# Altium project Main IF Board 6.PrjPcb
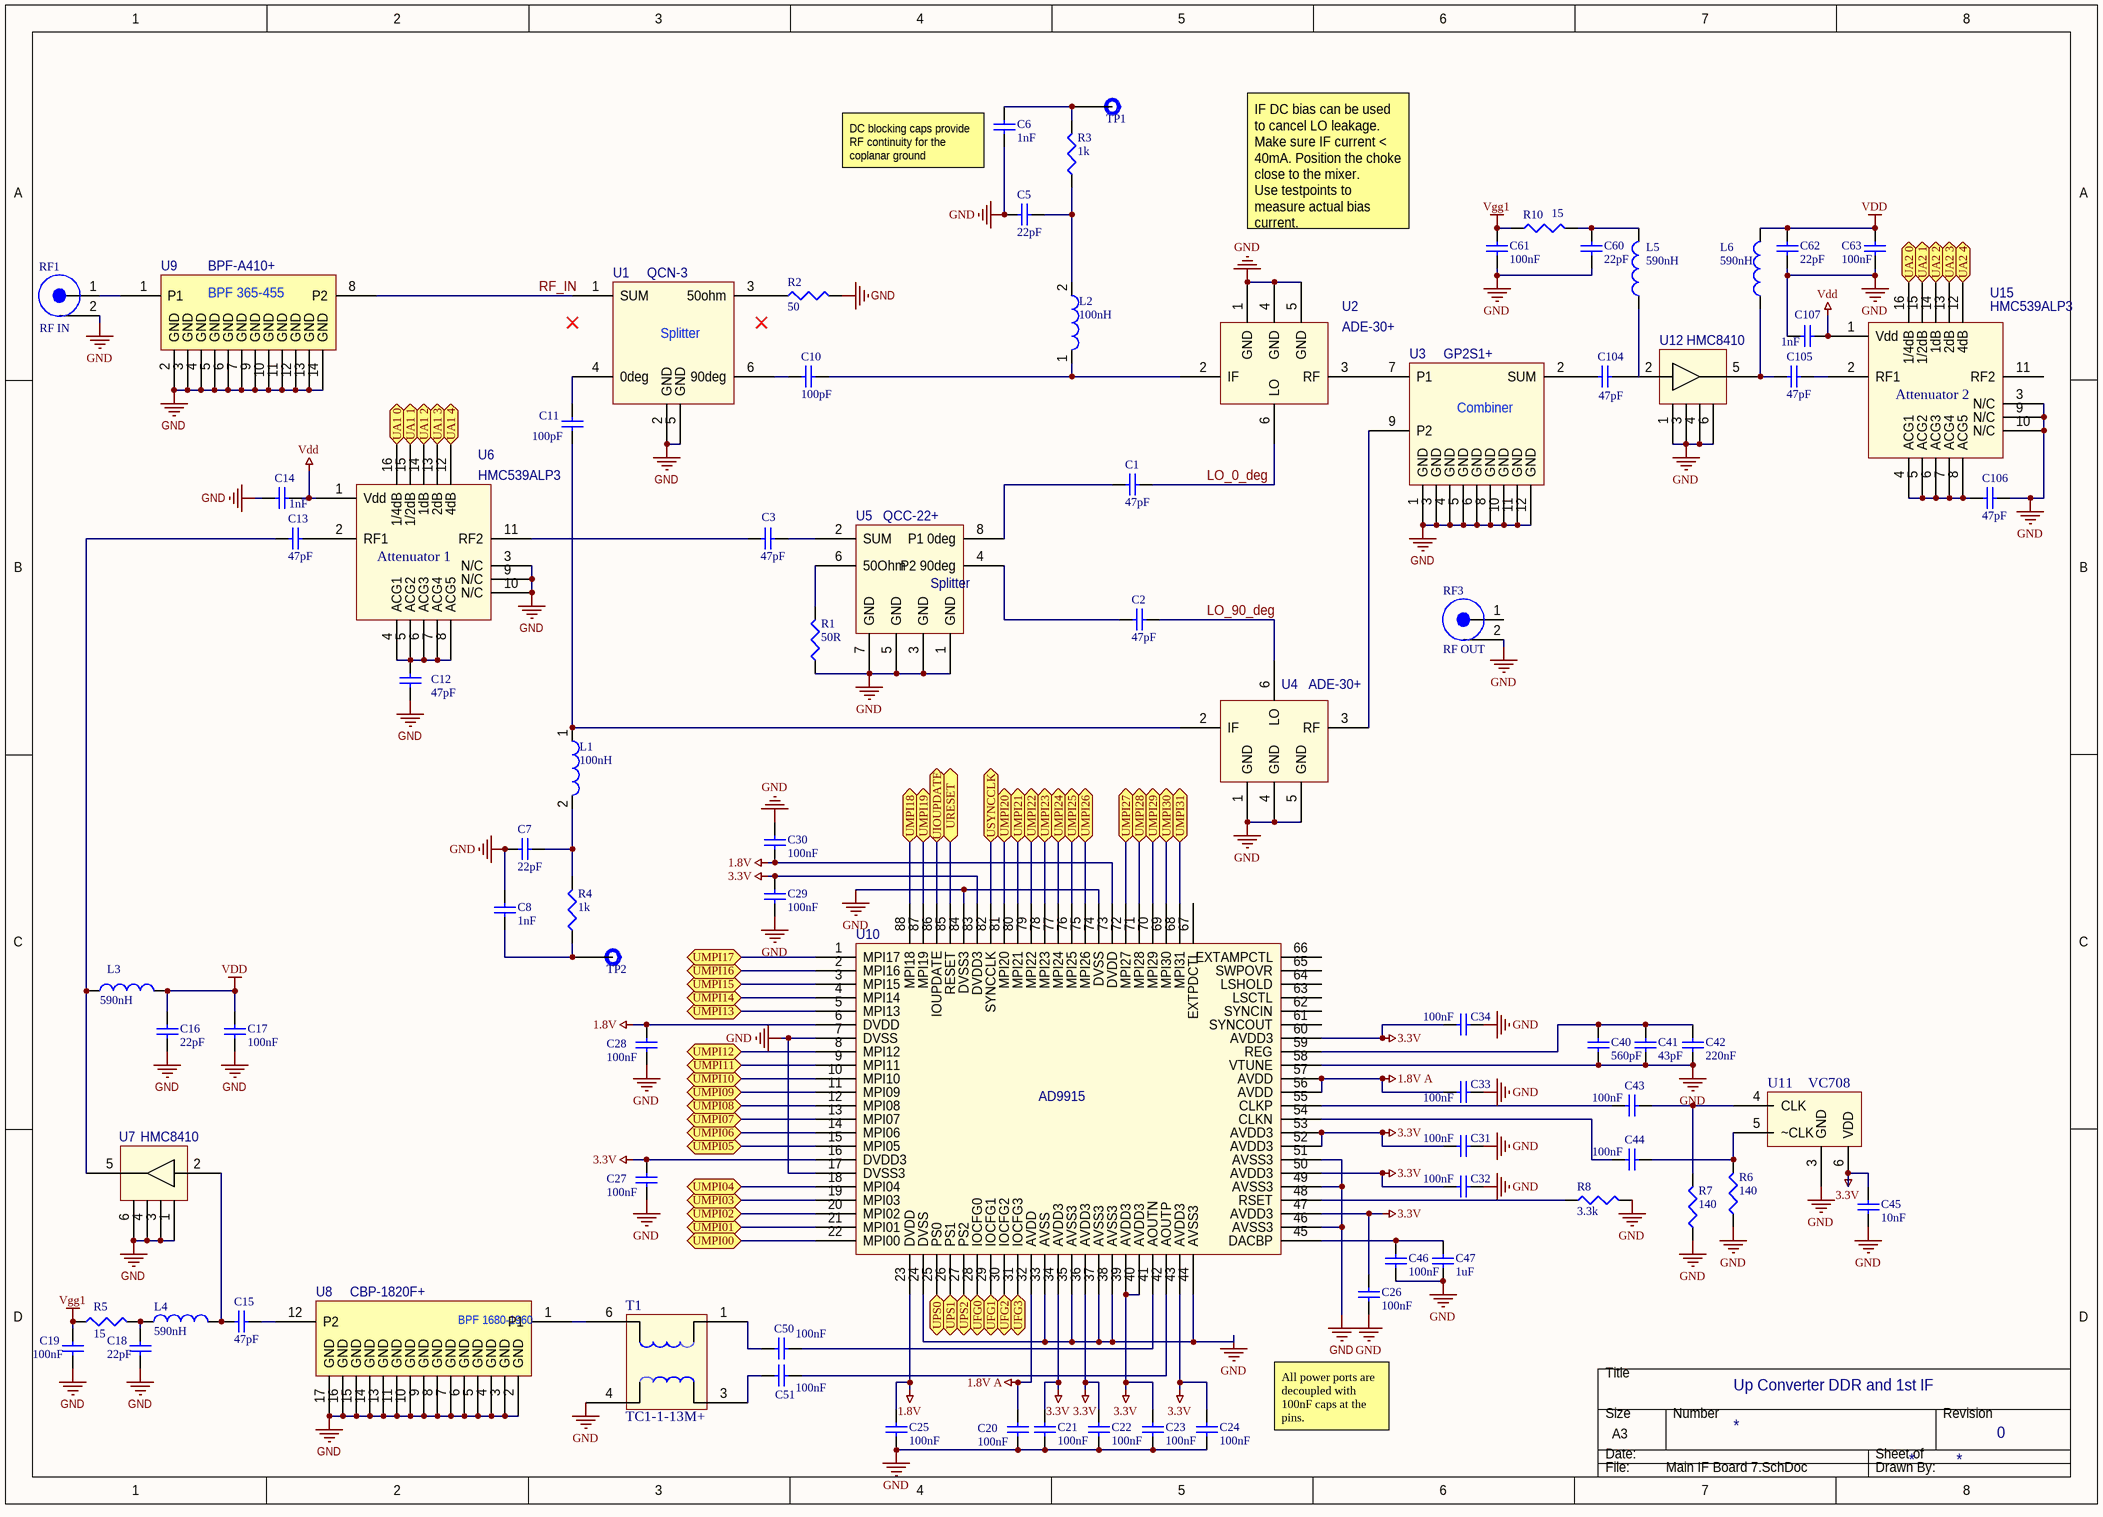
[diagram p0: Main IF Board 7.SchDoc]
2 sheets, 84 parts. Net scope: flat (ports and power ports of the same name join across sheets).
Sheets:
  Main IF Board 7.SchDoc
  Main IF Board A.SchDoc

## Sheet Main IF Board 7.SchDoc: Up Converter DDR and 1st IF
size A3; Author: L Lerner; Revision: 0

### Parts
C1  value 47pF  [CAP0402]  (hidden comment: ATC520L103KT16T)
C2  value 47pF  [CAP0402]  (hidden comment: ATC520L103KT16T)
C3  value 47pF  [CAP0402]  (hidden comment: ATC520L103KT16T)
C5  value 22pF  [CAP0402]  (hidden comment: Capacitor)
C6  value 1nF  [CAP0603]  (hidden comment: Capacitor)
C7  value 22pF  [CAP0402]  (hidden comment: Capacitor)
C8  value 1nF  [CAP0603]  (hidden comment: Capacitor)
C10  value 100pF  [CAP0402]  (hidden comment: Capacitor)
C11  value 100pF  [CAP0402]  (hidden comment: Capacitor)
C12  value 47pF  [CAP0402]  (hidden comment: Capacitor)
C13  value 47pF  [CAP0402]  (hidden comment: Capacitor)
C14  value 1nF  [CAP0402]  (hidden comment: Capacitor)
C15  value 47pF  [CAP0402]  (hidden comment: Capacitor)
C16  value 22pF  [CAP0402]  (hidden comment: Capacitor)
C17  value 100nF  [CAP0402]  (hidden comment: Capacitor)
C18  value 22pF  [CAP0402]  (hidden comment: Capacitor)
C19  value 100nF  [CAP0603]  (hidden comment: Capacitor)
C20  value 100nF  [CAP0402]  (hidden comment: Capacitor)
C21  value 100nF  [CAP0402]  (hidden comment: Capacitor)
C22  value 100nF  [CAP0402]  (hidden comment: Capacitor)
C23  value 100nF  [CAP0402]  (hidden comment: Capacitor)
C24  value 100nF  [CAP0402]  (hidden comment: Capacitor)
C25  value 100nF  [CAP0402]  (hidden comment: Capacitor)
C26  value 100nF  [CAP0402]  (hidden comment: Capacitor)
C27  value 100nF  [CAP0402]  (hidden comment: Capacitor)
C28  value 100nF  [CAP0402]  (hidden comment: Capacitor)
C29  value 100nF  [CAP0402]  (hidden comment: Capacitor)
C30  value 100nF  [CAP0402]  (hidden comment: Capacitor)
C31  value 100nF  [CAP0402]  (hidden comment: Capacitor)
C32  value 100nF  [CAP0402]  (hidden comment: Capacitor)
C33  value 100nF  [CAP0402]  (hidden comment: Capacitor)
C34  value 100nF  [CAP0402]  (hidden comment: Capacitor)
C40  value 560pF  [CAP0402]  (hidden comment: Capacitor)
C41  value 43pF  [CAP0402]  (hidden comment: Capacitor)
C42  value 220nF  [CAP0603]  (hidden comment: Capacitor)
C43  value 100nF  [CAP0402]  (hidden comment: Capacitor)
C44  value 100nF  [CAP0402]  (hidden comment: Capacitor)
C45  value 10nF  [CAP0402]  (hidden comment: Capacitor)
C46  value 100nF  [CAP0402]  (hidden comment: Capacitor)
C47  value 1uF  [CAP0603]  (hidden comment: Capacitor)
C50  value 100nF  [CAP0402]  (hidden comment: Capacitor)
C51  value 100nF  [CAP0402]  (hidden comment: Capacitor)
C60  value 22pF  [CAP0402]  (hidden comment: Capacitor)
C61  value 100nF  [CAP0402]  (hidden comment: Capacitor)
C62  value 22pF  [CAP0402]  (hidden comment: Capacitor)
C63  value 100nF  [CAP0402]  (hidden comment: Capacitor)
C104  value 47pF  [CAP0402]  (hidden comment: ATC520L103KT16T)
C105  value 47pF  [CAP0402]  (hidden comment: Capacitor)
C106  value 47pF  [CAP0402]  (hidden comment: Capacitor)
C107  value 1nF  [CAP0402]  (hidden comment: Capacitor)
L1  value 100nH  [Coilcraft_BCL-122]  (hidden comment: Inductor)
L2  value 100nH  [Coilcraft_BCL-122]  (hidden comment: Inductor)
L3  value 590nH  [CAP0402]  (hidden comment: Inductor)
L4  value 590nH  [CAP0402]  (hidden comment: Inductor)
L5  value 590nH  [CAP0402]  (hidden comment: Inductor)
L6  value 590nH  [TBD]  (hidden comment: Inductor)
R1  value 50R  [RES0603]  (hidden comment: Resistor)
R2  value 50  [RES0603]  (hidden comment: Resistor)
R3  value 1k  [RES0603]  (hidden comment: Resistor)
R4  value 1k  [RES0603]  (hidden comment: Resistor)
R5  value 15  [RES0402]  (hidden comment: Resistor)
R6  value 140  [RES0402]  (hidden comment: Resistor)
R7  value 140  [RES0402]  (hidden comment: Resistor)
R8  value 3.3k  [RES0402]  (hidden comment: Resistor)
R10  value 15  [RES0402]  (hidden comment: Resistor)
RF1  RF IN  [SMA_edge_launch_cutout_Cinch]
RF3  RF OUT  [SMA_edge_launch_cutout_Cinch]
T1  TC1-1-13M+
TP1  TP1  [1XHeader 100mil]  (value not drawn)
TP2  TP2  [1XHeader 100mil]  (value not drawn)
U1  QCN-3  [FV1206-1]
U2  ADE-30+  [Minicircuits_CD542]
U3  GP2S1+  [DQ1225]
U4  ADE-30+  [Minicircuits_CD542]
U5  QCC-22+  [Minicircuits_GF981]
U6  HMC539ALP3
U7  HMC8410
U8  CBP-1820F+  [CBP-1820F+]
U9  BPF-A410+  [BPF-A410+]
U10  AD9915  [AD9915]
U11  VC708  [VC708]
U12  HMC8410  [HMC8410]
U15  HMC539ALP3  [HMC539ALP3]

### Ports
UA1 0 (bidir), UA1 1 (bidir), UA1 2 (bidir), UA1 3 (bidir), UA1 4 (bidir), UA2 0 (bidir), UA2 1 (bidir), UA2 2 (bidir), UA2 3 (bidir), UA2 4 (bidir), UFG0 (bidir), UFG1 (bidir), UFG2 (bidir), UFG3 (bidir), UIOUPDATE (bidir), UMPI00 (bidir), UMPI01 (bidir), UMPI02 (bidir), UMPI03 (bidir), UMPI04 (bidir), UMPI05 (bidir), UMPI06 (bidir), UMPI07 (bidir), UMPI08 (bidir), UMPI09 (bidir), UMPI10 (bidir), UMPI11 (bidir), UMPI12 (bidir), UMPI13 (bidir), UMPI14 (bidir), UMPI15 (bidir), UMPI16 (bidir), UMPI17 (bidir), UMPI18 (bidir), UMPI19 (bidir), UMPI20 (bidir), UMPI21 (bidir), UMPI22 (bidir), UMPI23 (bidir), UMPI24 (bidir), UMPI25 (bidir), UMPI26 (bidir), UMPI27 (bidir), UMPI28 (bidir), UMPI29 (bidir), UMPI30 (bidir), UMPI31 (bidir), UPS0 (bidir), UPS1 (bidir), UPS2 (bidir), URESET (bidir), USYNCCLK (bidir)

### Nets
1.8V: C25.2 C28.2 C30.1 U10.6(DVDD) U10.23(DVDD) U10.73(DVDD)
1.8V A: C20.2 C33.1 U10.32(AVDD) U10.56(AVDD) U10.57(AVDD)
3.3V: C21.2 C22.2 C23.2 C24.2 C26.2 C27.1 C29.2 C31.1 C32.1 C34.1 C45.2 U10.16(DVDD3) U10.34(AVDD3) U10.36(AVDD3) U10.39(AVDD3) U10.40(AVDD3) U10.43(AVDD3) U10.47(AVDD3) U10.50(AVDD3) U10.52(AVDD3) U10.53(AVDD3) U10.60(AVDD3) U10.83(DVDD3) U11.6(VDD)
GND: C5.1 C6.2 C7.1 C8.2 C12.1 C14.1 C16.1 C17.1 C18.1 C19.1 C20.1 C21.1 C22.1 C23.1 C24.1 C25.1 C26.1 C27.2 C28.1 C29.1 C30.2 C31.2 C32.2 C33.2 C34.2 C40.1 C41.1 C42.1 C45.1 C46.1 C47.1 C60.1 C61.1 C62.1 C63.1 C106.2 C107.1 R1.1 R2.2 R6.1 R7.1 R8.2 RF1.2 RF3.2 T1.4 U1.2(GND) U1.5(GND) U2.1(GND) U2.4(GND) U2.5(GND) U3.1(GND) U3.3(GND) U3.4(GND) U3.5(GND) U3.6(GND) U3.8(GND) U3.10(GND) U3.11(GND) U3.12(GND) U4.1(GND) U4.4(GND) U4.5(GND) U5.1(GND) U5.3(GND) U5.5(GND) U5.7(GND) U6.3(N/C) U6.9(N/C) U6.10(N/C) U7.1 U7.3 U7.4 U7.6 U8.2(GND) U8.3(GND) U8.4(GND) U8.5(GND) U8.6(GND) U8.7(GND) U8.8(GND) U8.9(GND) U8.10(GND) U8.11(GND) U8.13(GND) U8.14(GND) U8.15(GND) U8.16(GND) U8.17(GND) U9.2(GND) U9.3(GND) U9.4(GND) U9.5(GND) U9.6(GND) U9.7(GND) U9.9(GND) U9.10(GND) U9.11(GND) U9.12(GND) U9.13(GND) U9.14(GND) U10.7(DVSS) U10.17(DVSS3) U10.24(DVSS) U10.33(AVSS) U10.35(AVSS3) U10.37(AVSS3) U10.38(AVSS3) U10.44(AVSS3) U10.46(AVSS3) U10.49(AVSS3) U10.51(AVSS3) U10.58(VTUNE) U10.74(DVSS) U10.84(DVSS3) U11.3(GND) U12.1 U12.3 U12.4 U12.6 U15.3(N/C) U15.9(N/C) U15.10(N/C)
VDD: C14.2 C16.2 C17.2 C62.2 C63.2 C107.2 L3.2 L6.2 U6.1(Vdd) U15.1(Vdd)
Vgg1: C19.2 C61.2 R5.1 R10.1
LO_0_deg: C1.1 U2.6(LO)
LO_90_deg: C2.2 U4.6(LO)
RF_IN: U1.1(SUM) U9.8(P2)
NetC1_2: C1.2 U5.8(P1_0deg)
NetC2_1: C2.1 U5.4(P2_90deg)
NetC3_1: C3.1 U6.11(RF2)
NetC3_2: C3.2 U5.2(SUM)
NetC5_2: C5.2 L2.2 R3.2
NetC6_1: C6.1 R3.1 TP1.1
NetC7_2: C7.2 L1.2 R4.2
NetC8_1: C8.1 R4.1 TP2.1
NetC10_1: C10.1 U1.6(90deg)
NetC10_2: C10.2 L2.1 U2.2(IF)
NetC11_1: C11.1 U1.4(0deg)
NetC11_2: C11.2 L1.1 U4.2(IF)
NetC12_2: C12.2 U6.4(ACG1) U6.5(ACG2) U6.6(ACG3) U6.7(ACG4) U6.8(ACG5)
NetC13_1: C13.1 L3.1 U7.5
NetC13_2: C13.2 U6.2(RF1)
NetC15_1: C15.1 L4.2 U7.2
NetC15_2: C15.2 U8.12(P2)
NetC18_2: C18.2 L4.1 R5.2
NetC40_2: C40.2 C41.2 C42.2 U10.59(REG)
NetC43_1: C43.1 U10.55(CLKP)
NetC43_2: C43.2 R7.2 U11.4(CLK)
NetC44_1: C44.1 U10.54(CLKN)
NetC44_2: C44.2 R6.2 U11.5(~CLK)
NetC46_2: C46.2 C47.2 U10.45(DACBP)
NetC50_1: C50.1 T1.1
NetC50_2: C50.2 U10.41(AOUTN)
NetC51_1: C51.1 T1.3
NetC51_2: C51.2 U10.42(AOUTP)
NetC60_2: C60.2 L5.2 R10.2
NetC104_1: C104.1 U12.2
NetC104_2: C104.2 U3.2(SUM)
NetC105_1: C105.1 L6.1 U12.5
NetC105_2: C105.2 U15.2(RF1)
NetC106_1: C106.1 U15.4(ACG1) U15.5(ACG2) U15.6(ACG3) U15.7(ACG4) U15.8(ACG5)
NetJXN_213: U10.87(MPI19) ; port UMPI19
NetJXN_217: U10.86(IOUPDATE) ; port UIOUPDATE
NetJXN_218: U10.18(MPI04) ; port UMPI04
NetJXN_219: U10.5(MPI13) ; port UMPI13
NetJXN_220: U10.19(MPI03) ; port UMPI03
NetJXN_223: U10.4(MPI14) ; port UMPI14
NetJXN_224: U10.20(MPI02) ; port UMPI02
NetJXN_226: U10.21(MPI01) ; port UMPI01
NetJXN_229: U15.15(1/2dB) ; port UA2 1
NetJXN_230: U10.22(MPI00) ; port UMPI00
NetJXN_231: U15.16(1/4dB) ; port UA2 0
NetJXN_235: U6.12(4dB) ; port UA1 4
NetJXN_236: U10.68(MPI31) ; port UMPI31
NetJXN_237: U6.13(2dB) ; port UA1 3
NetJXN_238: U10.69(MPI30) ; port UMPI30
NetJXN_241: U10.76(MPI25) ; port UMPI25
NetJXN_242: U10.72(MPI27) ; port UMPI27
NetJXN_243: U10.77(MPI24) ; port UMPI24
NetJXN_244: U10.75(MPI26) ; port UMPI26
NetJXN_248: U10.82(SYNCCLK) ; port USYNCCLK
NetJXN_253: U10.80(MPI21) ; port UMPI21
NetJXN_254: U10.78(MPI23) ; port UMPI23
NetJXN_255: U10.81(MPI20) ; port UMPI20
NetJXN_256: U10.79(MPI22) ; port UMPI22
NetJXN_261: U10.70(MPI29) ; port UMPI29
NetJXN_262: U10.8(MPI12) ; port UMPI12
NetJXN_263: U10.71(MPI28) ; port UMPI28
NetJXN_264: U10.9(MPI11) ; port UMPI11
NetJXN_267: U10.14(MPI06) ; port UMPI06
NetJXN_268: U15.13(2dB) ; port UA2 3
NetJXN_269: U10.15(MPI05) ; port UMPI05
NetJXN_270: U15.14(1dB) ; port UA2 2
NetJXN_273: U10.2(MPI16) ; port UMPI16
NetJXN_274: U6.14(1dB) ; port UA1 2
NetJXN_275: U10.3(MPI15) ; port UMPI15
NetJXN_276: U6.15(1/2dB) ; port UA1 1
NetJXN_281: U10.88(MPI18) ; port UMPI18
NetJXN_282: U6.16(1/4dB) ; port UA1 0
NetJXN_283: U10.1(MPI17) ; port UMPI17
NetJXN_284: U15.12(4dB) ; port UA2 4
NetJXN_287: U10.12(MPI08) ; port UMPI08
NetJXN_288: U10.10(MPI10) ; port UMPI10
NetJXN_289: U10.13(MPI07) ; port UMPI07
NetJXN_290: U10.11(MPI09) ; port UMPI09
NetR1_2: R1.2 U5.6(50Ohm)
NetR2_1: R2.1 U1.3(50ohm)
NetR8_1: R8.1 U10.48(RSET)
NetRF1_1: RF1.1 U9.1(P1)
NetT1_6: T1.6 U8.1(P1)
NetU2_3: U2.3(RF) U3.7(P1)
NetU3_9: U3.9(P2) U4.3(RF)
NetU10_25: U10.25(PS0) ; port UPS0
NetU10_26: U10.26(PS1) ; port UPS1
NetU10_27: U10.27(PS2) ; port UPS2
NetU10_28: U10.28(IOCFG0) ; port UFG0
NetU10_29: U10.29(IOCFG1) ; port UFG1
NetU10_30: U10.30(IOCFG2) ; port UFG2
NetU10_31: U10.31(IOCFG3) ; port UFG3
NetU10_85: U10.85(RESET) ; port URESET

Not connected (* = marked no-connect by the designer): L5 1; RF3 1; U10 61(SYNCOUT) 62(SYNCIN) 63(LSCTL) 64(LSHOLD) 65(SWPOVR) 66(EXTAMPCTL) 67(EXTPDCTL); U15 11(RF2)

### Notes on the sheet
- (near C6) DC blocking caps provide RF continuity for the coplanar ground
- IF DC bias can be used to cancel LO leakage. Make sure IF current < 40mA. Position the choke close to the mixer.
  Use testpoints to measure actual bias current.
- (near U15) Attenuator 2
- (near U6) Attenuator 1
- All power ports are decoupled with 100nF caps at the pins.
- (in symbol BPF-A410+) BPF 365-455
- (in symbol CBP-1820F+) BPF 1680-1960
- (in symbol GP2S1+) Combiner
- (in symbol minicircuits_QCC-22+) Splitter
- (in symbol QCN-3) Splitter

### Library data of the parts
C1-C3 C104 = Capacitor
L3 L4 = Inductor: Model: 0402DF-591XJRU
RF1 RF3 = RF_connector: RF connector w/  pin and barrel
T1 = Trans: Published: 24-Mar-1999; LatestRevisionDate: 08-Jul-2005; LatestRevisionNote: Mech Layer 1 removed.; PackageReference: TRANS; Publisher: Altium Limited; PackageDescription: Transformer; 4 Leads
TP1 TP2 = Test point
U2 U4 = minicircuits_ADE-30+: Minicircuits mixer ADE-30+, 200MHz-3000MHz
U5 = minicircuits_QCC-22+: Mini-Circuits_ power splitter/combiner QCC-22+, 1.5-2.5GHz
U11 = VC-708
C5-C8 C10-C34 C40-C47 C50 C51 C60-C63 C105-C107 = Capacitor
  C10-C34 C40-C47 C50 C51 C60-C63 C105-C107: Dielectric: *; Model: *; Voltage: *
L1 L2 L5 L6 = Inductor
  L5 L6: Model: *
R1-R8 R10 = Resistor
  R2-R8 R10: Type: *; Model: *

## Sheet Main IF Board A.SchDoc: Up/Down Converter SOM Header
size A4
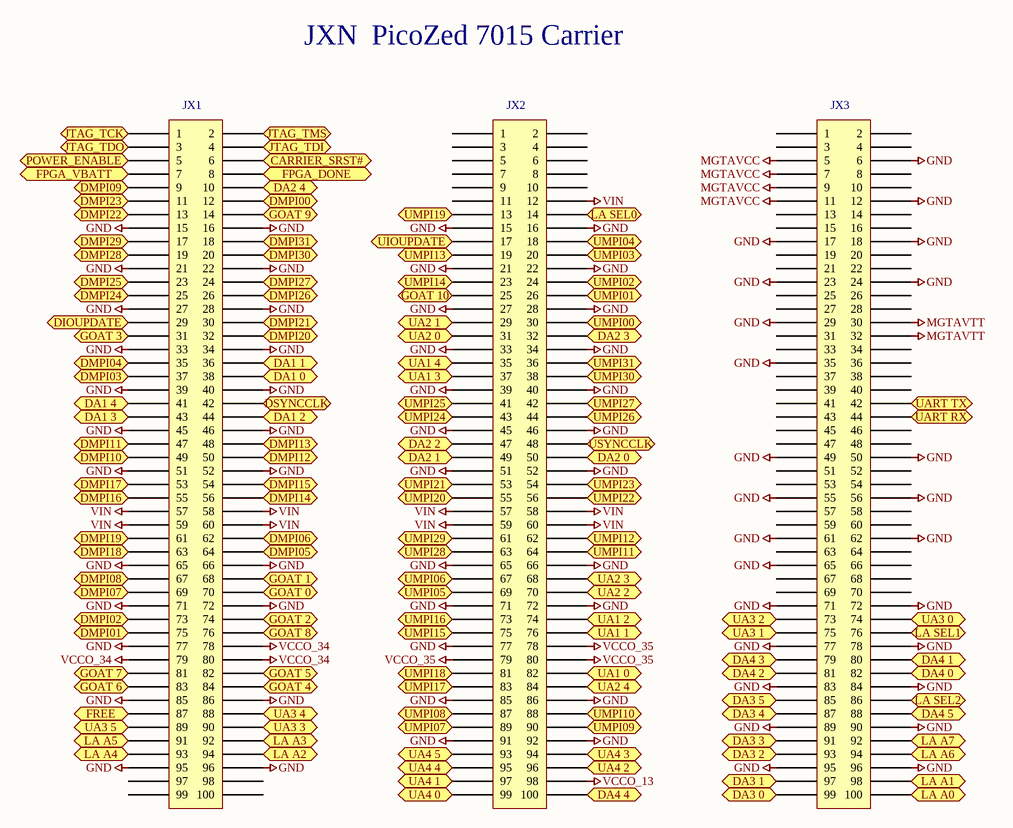
[diagram p1: Main IF Board A.SchDoc]

### Parts
JXN  PicoZed 7015 Carrier  [BergStak61083]

### Ports
CARRIER_SRST# (bidir), DA1 0 (bidir), DA1 1 (bidir), DA1 2 (bidir), DA1 3 (bidir), DA1 4 (bidir), DA2 0 (bidir), DA2 1 (bidir), DA2 2 (bidir), DA2 3 (bidir), DA2 4 (bidir), DA3 0 (bidir), DA3 1 (bidir), DA3 2 (bidir), DA3 3 (bidir), DA3 4 (bidir), DA3 5 (bidir), DA4 0 (bidir), DA4 1 (bidir), DA4 2 (bidir), DA4 3 (bidir), DA4 4 (bidir), DA4 5 (bidir), DIOUPDATE (bidir), DMPI00 (bidir), DMPI01 (bidir), DMPI02 (bidir), DMPI03 (bidir), DMPI04 (bidir), DMPI05 (bidir), DMPI06 (bidir), DMPI07 (bidir), DMPI08 (bidir), DMPI09 (bidir), DMPI10 (bidir), DMPI11 (bidir), DMPI12 (bidir), DMPI13 (bidir), DMPI14 (bidir), DMPI15 (bidir), DMPI16 (bidir), DMPI17 (bidir), DMPI18 (bidir), DMPI19 (bidir), DMPI20 (bidir), DMPI21 (bidir), DMPI22 (bidir), DMPI23 (bidir), DMPI24 (bidir), DMPI25 (bidir), DMPI26 (bidir), DMPI27 (bidir), DMPI28 (bidir), DMPI29 (bidir), DMPI30 (bidir), DMPI31 (bidir), DSYNCCLK (bidir), FPGA_DONE (bidir), FPGA_VBATT (bidir), FREE (bidir), GOAT 0 (bidir), GOAT 1 (bidir), GOAT 2 (bidir), GOAT 3 (bidir), GOAT 4 (bidir), GOAT 5 (bidir), GOAT 6 (bidir), GOAT 7 (bidir), GOAT 8 (bidir), GOAT 9 (bidir), GOAT 10 (bidir), JTAG_TCK (bidir), JTAG_TDI (bidir), JTAG_TDO (bidir), JTAG_TMS (bidir), LA A0 (bidir), LA A1 (bidir), LA A2 (bidir), LA A3 (bidir), LA A4 (bidir), LA A5 (bidir), LA A6 (bidir), LA A7 (bidir), LA SEL0 (bidir), LA SEL1 (bidir), LA SEL2 (bidir), POWER_ENABLE (bidir), UA1 0 (bidir), UA1 1 (bidir), UA1 2 (bidir), UA1 3 (bidir), UA1 4 (bidir), UA2 0 (bidir), UA2 1 (bidir), UA2 2 (bidir), UA2 3 (bidir), UA2 4 (bidir), UA3 0 (bidir), UA3 1 (bidir), UA3 2 (bidir), UA3 3 (bidir), UA3 4 (bidir), UA3 5 (bidir), UA4 0 (bidir), UA4 1 (bidir), UA4 2 (bidir), UA4 3 (bidir), UA4 4 (bidir), UA4 5 (bidir), UART RX (bidir), UART TX (bidir), UIOUPDATE (bidir), UMPI00 (bidir), UMPI01 (bidir), UMPI02 (bidir), UMPI03 (bidir), UMPI04 (bidir), UMPI05 (bidir), UMPI06 (bidir), UMPI07 (bidir), UMPI08 (bidir), UMPI09 (bidir), UMPI10 (bidir), UMPI11 (bidir), UMPI12 (bidir), UMPI13 (bidir), UMPI14 (bidir), UMPI15 (bidir), UMPI16 (bidir), UMPI17 (bidir), UMPI18 (bidir), UMPI19 (bidir), UMPI20 (bidir), UMPI21 (bidir), UMPI22 (bidir), UMPI23 (bidir), UMPI24 (bidir), UMPI25 (bidir), UMPI26 (bidir), UMPI27 (bidir), UMPI28 (bidir), UMPI29 (bidir), UMPI30 (bidir), UMPI31 (bidir), USYNCCLK (bidir)

### Nets
GND: JXN.115(15) JXN.116(16) JXN.121(21) JXN.122(22) JXN.127(27) JXN.128(28) JXN.133(33) JXN.134(34) JXN.139(39) JXN.140(40) JXN.145(45) JXN.146(46) JXN.151(51) JXN.152(52) JXN.165(65) JXN.166(66) JXN.171(71) JXN.172(72) JXN.177(77) JXN.185(85) JXN.186(86) JXN.195(95) JXN.196(96) JXN.215(15) JXN.216(16) JXN.221(21) JXN.222(22) JXN.227(27) JXN.228(28) JXN.233(33) JXN.234(34) JXN.239(39) JXN.240(40) JXN.245(45) JXN.246(46) JXN.251(51) JXN.252(52) JXN.265(65) JXN.266(66) JXN.271(71) JXN.272(72) JXN.277(77) JXN.285(85) JXN.286(86) JXN.291(91) JXN.292(92) JXN.306(6) JXN.312(12) JXN.317(17) JXN.318(18) JXN.323(23) JXN.324(24) JXN.329(29) JXN.335(35) JXN.349(49) JXN.350(50) JXN.355(55) JXN.356(56) JXN.361(61) JXN.362(62) JXN.365(65) JXN.371(71) JXN.372(72) JXN.377(77) JXN.378(78) JXN.383(83) JXN.384(84) JXN.389(89) JXN.390(90) JXN.395(95) JXN.396(96)
MGTAVCC: JXN.305(5) JXN.307(7) JXN.309(9) JXN.311(11)
MGTAVTT: JXN.330(30) JXN.332(32)
VCCO_13: JXN.298(98)
VCCO_34: JXN.178(78) JXN.179(79) JXN.180(80)
VCCO_35: JXN.278(78) JXN.279(79) JXN.280(80)
VIN: JXN.157(57) JXN.158(58) JXN.159(59) JXN.160(60) JXN.212(12) JXN.257(57) JXN.258(58) JXN.259(59) JXN.260(60)
NetJXN_101: JXN.101(1) ; port JTAG_TCK
NetJXN_102: JXN.102(2) ; port JTAG_TMS
NetJXN_103: JXN.103(3) ; port JTAG_TDO
NetJXN_104: JXN.104(4) ; port JTAG_TDI
NetJXN_105: JXN.105(5) ; port POWER_ENABLE
NetJXN_106: JXN.106(6) ; port CARRIER_SRST#
NetJXN_107: JXN.107(7) ; port FPGA_VBATT
NetJXN_108: JXN.108(8) ; port FPGA_DONE
NetJXN_109: JXN.109(9) ; port DMPI09
NetJXN_110: JXN.110(10) ; port DA2 4
NetJXN_111: JXN.111(11) ; port DMPI23
NetJXN_112: JXN.112(12) ; port DMPI00
NetJXN_113: JXN.113(13) ; port DMPI22
NetJXN_114: JXN.114(14) ; port GOAT 9
NetJXN_117: JXN.117(17) ; port DMPI29
NetJXN_118: JXN.118(18) ; port DMPI31
NetJXN_119: JXN.119(19) ; port DMPI28
NetJXN_120: JXN.120(20) ; port DMPI30
NetJXN_123: JXN.123(23) ; port DMPI25
NetJXN_124: JXN.124(24) ; port DMPI27
NetJXN_125: JXN.125(25) ; port DMPI24
NetJXN_126: JXN.126(26) ; port DMPI26
NetJXN_129: JXN.129(29) ; port DIOUPDATE
NetJXN_130: JXN.130(30) ; port DMPI21
NetJXN_131: JXN.131(31) ; port GOAT 3
NetJXN_132: JXN.132(32) ; port DMPI20
NetJXN_135: JXN.135(35) ; port DMPI04
NetJXN_136: JXN.136(36) ; port DA1 1
NetJXN_137: JXN.137(37) ; port DMPI03
NetJXN_138: JXN.138(38) ; port DA1 0
NetJXN_141: JXN.141(41) ; port DA1 4
NetJXN_142: JXN.142(42) ; port DSYNCCLK
NetJXN_143: JXN.143(43) ; port DA1 3
NetJXN_144: JXN.144(44) ; port DA1 2
NetJXN_147: JXN.147(47) ; port DMPI11
NetJXN_148: JXN.148(48) ; port DMPI13
NetJXN_149: JXN.149(49) ; port DMPI10
NetJXN_150: JXN.150(50) ; port DMPI12
NetJXN_153: JXN.153(53) ; port DMPI17
NetJXN_154: JXN.154(54) ; port DMPI15
NetJXN_155: JXN.155(55) ; port DMPI16
NetJXN_156: JXN.156(56) ; port DMPI14
NetJXN_161: JXN.161(61) ; port DMPI19
NetJXN_162: JXN.162(62) ; port DMPI06
NetJXN_163: JXN.163(63) ; port DMPI18
NetJXN_164: JXN.164(64) ; port DMPI05
NetJXN_167: JXN.167(67) ; port DMPI08
NetJXN_168: JXN.168(68) ; port GOAT 1
NetJXN_169: JXN.169(69) ; port DMPI07
NetJXN_170: JXN.170(70) ; port GOAT 0
NetJXN_173: JXN.173(73) ; port DMPI02
NetJXN_174: JXN.174(74) ; port GOAT 2
NetJXN_175: JXN.175(75) ; port DMPI01
NetJXN_176: JXN.176(76) ; port GOAT 8
NetJXN_181: JXN.181(81) ; port GOAT 7
NetJXN_182: JXN.182(82) ; port GOAT 5
NetJXN_183: JXN.183(83) ; port GOAT 6
NetJXN_184: JXN.184(84) ; port GOAT 4
NetJXN_187: JXN.187(87) ; port FREE
NetJXN_188: JXN.188(88) ; port UA3 4
NetJXN_189: JXN.189(89) ; port UA3 5
NetJXN_190: JXN.190(90) ; port UA3 3
NetJXN_191: JXN.191(91) ; port LA A5
NetJXN_192: JXN.192(92) ; port LA A3
NetJXN_193: JXN.193(93) ; port LA A4
NetJXN_194: JXN.194(94) ; port LA A2
NetJXN_213: JXN.213(13) ; port UMPI19
NetJXN_214: JXN.214(14) ; port LA SEL0
NetJXN_217: JXN.217(17) ; port UIOUPDATE
NetJXN_218: JXN.218(18) ; port UMPI04
NetJXN_219: JXN.219(19) ; port UMPI13
NetJXN_220: JXN.220(20) ; port UMPI03
NetJXN_223: JXN.223(23) ; port UMPI14
NetJXN_224: JXN.224(24) ; port UMPI02
NetJXN_225: JXN.225(25) ; port GOAT 10
NetJXN_226: JXN.226(26) ; port UMPI01
NetJXN_229: JXN.229(29) ; port UA2 1
NetJXN_230: JXN.230(30) ; port UMPI00
NetJXN_231: JXN.231(31) ; port UA2 0
NetJXN_232: JXN.232(32) ; port DA2 3
NetJXN_235: JXN.235(35) ; port UA1 4
NetJXN_236: JXN.236(36) ; port UMPI31
NetJXN_237: JXN.237(37) ; port UA1 3
NetJXN_238: JXN.238(38) ; port UMPI30
NetJXN_241: JXN.241(41) ; port UMPI25
NetJXN_242: JXN.242(42) ; port UMPI27
NetJXN_243: JXN.243(43) ; port UMPI24
NetJXN_244: JXN.244(44) ; port UMPI26
NetJXN_247: JXN.247(47) ; port DA2 2
NetJXN_248: JXN.248(48) ; port USYNCCLK
NetJXN_249: JXN.249(49) ; port DA2 1
NetJXN_250: JXN.250(50) ; port DA2 0
NetJXN_253: JXN.253(53) ; port UMPI21
NetJXN_254: JXN.254(54) ; port UMPI23
NetJXN_255: JXN.255(55) ; port UMPI20
NetJXN_256: JXN.256(56) ; port UMPI22
NetJXN_261: JXN.261(61) ; port UMPI29
NetJXN_262: JXN.262(62) ; port UMPI12
NetJXN_263: JXN.263(63) ; port UMPI28
NetJXN_264: JXN.264(64) ; port UMPI11
NetJXN_267: JXN.267(67) ; port UMPI06
NetJXN_268: JXN.268(68) ; port UA2 3
NetJXN_269: JXN.269(69) ; port UMPI05
NetJXN_270: JXN.270(70) ; port UA2 2
NetJXN_273: JXN.273(73) ; port UMPI16
NetJXN_274: JXN.274(74) ; port UA1 2
NetJXN_275: JXN.275(75) ; port UMPI15
NetJXN_276: JXN.276(76) ; port UA1 1
NetJXN_281: JXN.281(81) ; port UMPI18
NetJXN_282: JXN.282(82) ; port UA1 0
NetJXN_283: JXN.283(83) ; port UMPI17
NetJXN_284: JXN.284(84) ; port UA2 4
NetJXN_287: JXN.287(87) ; port UMPI08
NetJXN_288: JXN.288(88) ; port UMPI10
NetJXN_289: JXN.289(89) ; port UMPI07
NetJXN_290: JXN.290(90) ; port UMPI09
NetJXN_293: JXN.293(93) ; port UA4 5
NetJXN_294: JXN.294(94) ; port UA4 3
NetJXN_295: JXN.295(95) ; port UA4 4
NetJXN_296: JXN.296(96) ; port UA4 2
NetJXN_297: JXN.297(97) ; port UA4 1
NetJXN_299: JXN.299(99) ; port UA4 0
NetJXN_300: JXN.300(100) ; port DA4 4
NetJXN_342: JXN.342(42) ; port UART TX
NetJXN_344: JXN.344(44) ; port UART RX
NetJXN_373: JXN.373(73) ; port UA3 2
NetJXN_374: JXN.374(74) ; port UA3 0
NetJXN_375: JXN.375(75) ; port UA3 1
NetJXN_376: JXN.376(76) ; port LA SEL1
NetJXN_379: JXN.379(79) ; port DA4 3
NetJXN_380: JXN.380(80) ; port DA4 1
NetJXN_381: JXN.381(81) ; port DA4 2
NetJXN_382: JXN.382(82) ; port DA4 0
NetJXN_385: JXN.385(85) ; port DA3 5
NetJXN_386: JXN.386(86) ; port LA SEL2
NetJXN_387: JXN.387(87) ; port DA3 4
NetJXN_388: JXN.388(88) ; port DA4 5
NetJXN_391: JXN.391(91) ; port DA3 3
NetJXN_392: JXN.392(92) ; port LA A7
NetJXN_393: JXN.393(93) ; port DA3 2
NetJXN_394: JXN.394(94) ; port LA A6
NetJXN_397: JXN.397(97) ; port DA3 1
NetJXN_398: JXN.398(98) ; port LA A1
NetJXN_399: JXN.399(99) ; port DA3 0
NetJXN_400: JXN.400(100) ; port LA A0

Not connected (* = marked no-connect by the designer): JXN 197(97) 198(98) 199(99) 200(100) 201(1) 202(2) 203(3) 204(4) 205(5) 206(6) 207(7) 208(8) 209(9) 210(10) 211(11) 301(1) 302(2) 303(3) 304(4) 308(8) 310(10) 313(13) 314(14) 315(15) 316(16) 319(19) 320(20) 321(21) 322(22) 325(25) 326(26) 327(27) 328(28) 331(31) 333(33) 334(34) 336(36) 337(37) 338(38) 339(39) 340(40) 341(41) 343(43) 345(45) 346(46) 347(47) 348(48) 351(51) 352(52) 353(53) 354(54) 357(57) 358(58) 359(59) 360(60) 363(63) 364(64) 366(66) 367(67) 368(68) 369(69) 370(70)

### Notes on the sheet
- (in symbol PicoZed7015 Carrier) JX1; JX2; JX3

### Library data of the parts
JXN = PicoZed7015 Carrier

## Nets that join several sheets
GND: Main IF Board 7 (122 pins), Main IF Board A (71 pins)
NetJXN_213: Main IF Board 7 (U10.87), Main IF Board A (JXN.213)
NetJXN_217: Main IF Board 7 (U10.86), Main IF Board A (JXN.217)
NetJXN_218: Main IF Board 7 (U10.18), Main IF Board A (JXN.218)
NetJXN_219: Main IF Board 7 (U10.5), Main IF Board A (JXN.219)
NetJXN_220: Main IF Board 7 (U10.19), Main IF Board A (JXN.220)
NetJXN_223: Main IF Board 7 (U10.4), Main IF Board A (JXN.223)
NetJXN_224: Main IF Board 7 (U10.20), Main IF Board A (JXN.224)
NetJXN_226: Main IF Board 7 (U10.21), Main IF Board A (JXN.226)
NetJXN_229: Main IF Board 7 (U15.15), Main IF Board A (JXN.229)
NetJXN_230: Main IF Board 7 (U10.22), Main IF Board A (JXN.230)
NetJXN_231: Main IF Board 7 (U15.16), Main IF Board A (JXN.231)
NetJXN_235: Main IF Board 7 (U6.12), Main IF Board A (JXN.235)
NetJXN_236: Main IF Board 7 (U10.68), Main IF Board A (JXN.236)
NetJXN_237: Main IF Board 7 (U6.13), Main IF Board A (JXN.237)
NetJXN_238: Main IF Board 7 (U10.69), Main IF Board A (JXN.238)
NetJXN_241: Main IF Board 7 (U10.76), Main IF Board A (JXN.241)
NetJXN_242: Main IF Board 7 (U10.72), Main IF Board A (JXN.242)
NetJXN_243: Main IF Board 7 (U10.77), Main IF Board A (JXN.243)
NetJXN_244: Main IF Board 7 (U10.75), Main IF Board A (JXN.244)
NetJXN_248: Main IF Board 7 (U10.82), Main IF Board A (JXN.248)
NetJXN_253: Main IF Board 7 (U10.80), Main IF Board A (JXN.253)
NetJXN_254: Main IF Board 7 (U10.78), Main IF Board A (JXN.254)
NetJXN_255: Main IF Board 7 (U10.81), Main IF Board A (JXN.255)
NetJXN_256: Main IF Board 7 (U10.79), Main IF Board A (JXN.256)
NetJXN_261: Main IF Board 7 (U10.70), Main IF Board A (JXN.261)
NetJXN_262: Main IF Board 7 (U10.8), Main IF Board A (JXN.262)
NetJXN_263: Main IF Board 7 (U10.71), Main IF Board A (JXN.263)
NetJXN_264: Main IF Board 7 (U10.9), Main IF Board A (JXN.264)
NetJXN_267: Main IF Board 7 (U10.14), Main IF Board A (JXN.267)
NetJXN_268: Main IF Board 7 (U15.13), Main IF Board A (JXN.268)
NetJXN_269: Main IF Board 7 (U10.15), Main IF Board A (JXN.269)
NetJXN_270: Main IF Board 7 (U15.14), Main IF Board A (JXN.270)
NetJXN_273: Main IF Board 7 (U10.2), Main IF Board A (JXN.273)
NetJXN_274: Main IF Board 7 (U6.14), Main IF Board A (JXN.274)
NetJXN_275: Main IF Board 7 (U10.3), Main IF Board A (JXN.275)
NetJXN_276: Main IF Board 7 (U6.15), Main IF Board A (JXN.276)
NetJXN_281: Main IF Board 7 (U10.88), Main IF Board A (JXN.281)
NetJXN_282: Main IF Board 7 (U6.16), Main IF Board A (JXN.282)
NetJXN_283: Main IF Board 7 (U10.1), Main IF Board A (JXN.283)
NetJXN_284: Main IF Board 7 (U15.12), Main IF Board A (JXN.284)
NetJXN_287: Main IF Board 7 (U10.12), Main IF Board A (JXN.287)
NetJXN_288: Main IF Board 7 (U10.10), Main IF Board A (JXN.288)
NetJXN_289: Main IF Board 7 (U10.13), Main IF Board A (JXN.289)
NetJXN_290: Main IF Board 7 (U10.11), Main IF Board A (JXN.290)